# Altium schematic sheet Servos.SchDoc
size A3; SheetNumber: 5; SheetTotal: 9
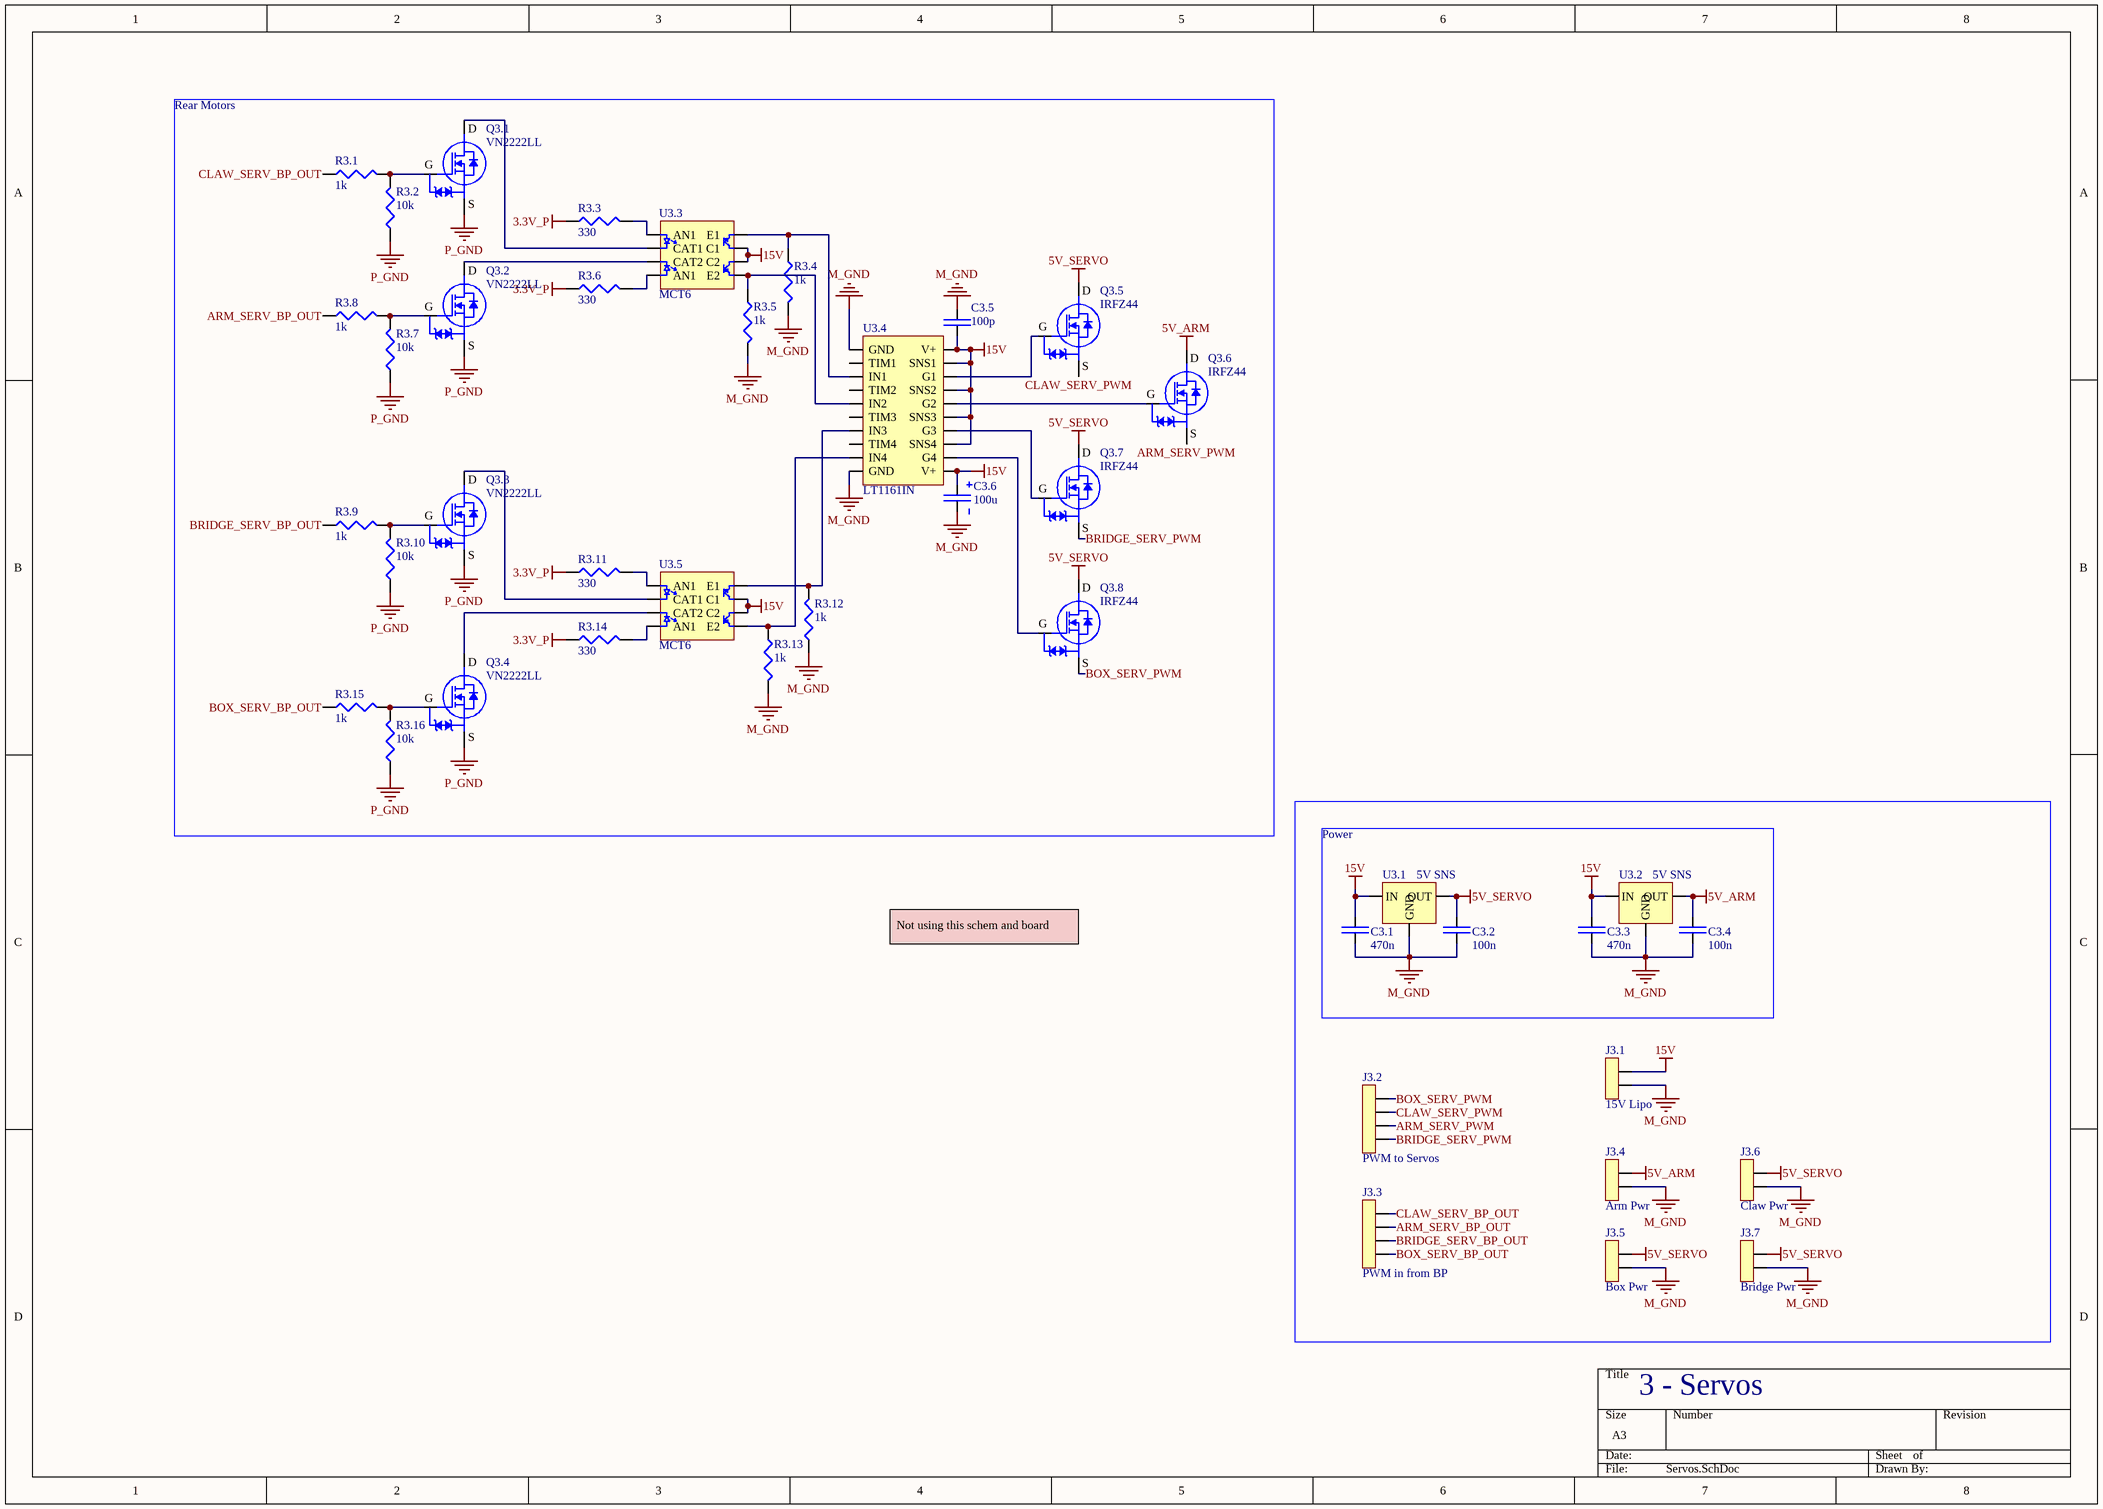
[diagram p0: Servos.SchDoc]

## Parts
C3.1  470n  [Non Polarized Cap]
C3.2  100n  [Non Polarized Cap]
C3.3  470n  [Non Polarized Cap]
C3.4  100n  [Non Polarized Cap]
C3.5  100p  [Non Polarized Cap]
C3.6  100u  [Polarized Cap]
J3.1  15V Lipo  [2pos JST]
J3.2  PWM to Servos  [4Pos JST]
J3.3  PWM in from BP  [4Pos JST]
J3.4  Arm Pwr  [2pos JST]
J3.5  Box Pwr  [2pos JST]
J3.6  Claw Pwr  [2pos JST]
J3.7  Bridge Pwr  [2pos JST]
Q3.1  VN2222LL  [VN2222LL]
Q3.2  VN2222LL  [VN2222LL]
Q3.3  VN2222LL  [VN2222LL]
Q3.4  VN2222LL  [VN2222LL]
Q3.5  IRFZ44  [TO220]
Q3.6  IRFZ44  [TO220]
Q3.7  IRFZ44  [TO220]
Q3.8  IRFZ44  [TO220]
R3.1  1k  [Res_Generic]
R3.2  10k  [Res_Generic]
R3.3  330  [Res_Generic]
R3.4  1k  [Res_Generic]
R3.5  1k  [Res_Generic]
R3.6  330  [Res_Generic]
R3.7  10k  [Res_Generic]
R3.8  1k  [Res_Generic]
R3.9  1k  [Res_Generic]
R3.10  10k  [Res_Generic]
R3.11  330  [Res_Generic]
R3.12  1k  [Res_Generic]
R3.13  1k  [Res_Generic]
R3.14  330  [Res_Generic]
R3.15  1k  [Res_Generic]
R3.16  10k  [Res_Generic]
U3.1  5V SNS  [TO220]
U3.2  5V SNS  [TO220]
U3.3  MCT6  [DIP8]
U3.4  LT1161IN  [DIP20]
U3.5  MCT6  [DIP8]

## Blocks framed on the sheet
Rear Motors: C3.5 C3.6 Q3.1-Q3.8 R3.1-R3.16 U3.3-U3.5
Power: C3.1-C3.4 U3.1 U3.2

## Nets
3.3V_P: R3.3.1 R3.6.1 R3.11.1 R3.14.1
5V_ARM: C3.4.2 J3.4.2 Q3.6.2(D) U3.2.3(OUT)
5V_SERVO: C3.2.2 J3.5.2 J3.6.2 J3.7.2 Q3.5.2(D) Q3.7.2(D) Q3.8.2(D) U3.1.3(OUT)
15V: C3.1.2 C3.3.2 C3.5.1 C3.6.1 J3.1.2 U3.1.1(IN) U3.2.1(IN) U3.3.6(C2) U3.3.7(C1) U3.4.11(V+) U3.4.13(SNS4) U3.4.15(SNS3) U3.4.17(SNS2) U3.4.19(SNS1) U3.4.20(V+) U3.5.6(C2) U3.5.7(C1)
M_GND: C3.1.1 C3.2.1 C3.3.1 C3.4.1 C3.5.2 C3.6.2 J3.1.1 J3.4.1 J3.5.1 J3.6.1 J3.7.1 R3.4.2 R3.5.2 R3.12.1 R3.13.2 U3.1.2(GND) U3.2.2(GND) U3.4.1(GND) U3.4.10(GND)
P_GND: Q3.1.1(S) Q3.2.1(S) Q3.3.1(S) Q3.4.1(S) R3.2.1 R3.7.1 R3.10.1 R3.16.1
ARM_SERV_BP_OUT: J3.3.3 R3.8.1
ARM_SERV_PWM: J3.2.2 Q3.6.3(S)
BOX_SERV_BP_OUT: J3.3.1 R3.15.1
BOX_SERV_PWM: J3.2.4 Q3.8.3(S)
BRIDGE_SERV_BP_OUT: J3.3.2 R3.9.1
BRIDGE_SERV_PWM: J3.2.1 Q3.7.3(S)
CLAW_SERV_BP_OUT: J3.3.4 R3.1.1
CLAW_SERV_PWM: J3.2.3 Q3.5.3(S)
NetQ3.1_2: Q3.1.2(G) R3.1.2 R3.2.2
NetQ3.1_3: Q3.1.3(D) U3.3.2(CAT1)
NetQ3.2_2: Q3.2.2(G) R3.7.2 R3.8.2
NetQ3.2_3: Q3.2.3(D) U3.3.3(CAT2)
NetQ3.3_2: Q3.3.2(G) R3.9.2 R3.10.2
NetQ3.3_3: Q3.3.3(D) U3.5.2(CAT1)
NetQ3.4_2: Q3.4.2(G) R3.15.2 R3.16.2
NetQ3.4_3: Q3.4.3(D) U3.5.3(CAT2)
NetQ3.5_1: Q3.5.1(G) U3.4.18(G1)
NetQ3.6_1: Q3.6.1(G) U3.4.16(G2)
NetQ3.7_1: Q3.7.1(G) U3.4.14(G3)
NetQ3.8_1: Q3.8.1(G) U3.4.12(G4)
NetR3.3_2: R3.3.2 U3.3.1(AN1)
NetR3.4_1: R3.4.1 U3.3.8(E1) U3.4.3(IN1)
NetR3.5_1: R3.5.1 U3.3.5(E2) U3.4.5(IN2)
NetR3.6_2: R3.6.2 U3.3.4(AN1)
NetR3.11_2: R3.11.2 U3.5.1(AN1)
NetR3.12_2: R3.12.2 U3.4.7(IN3) U3.5.8(E1)
NetR3.13_1: R3.13.1 U3.4.9(IN4) U3.5.5(E2)
NetR3.14_2: R3.14.2 U3.5.4(AN1)

Not connected (* = marked no-connect by the designer): U3.4 2(TIM1) 4(TIM2) 6(TIM3) 8(TIM4)

## Notes on the sheet
- Not using this schem and board
- 3 - Servos

## Library data of the parts
C3.1-C3.5 = Cap_Generic
C3.6 = Polarized Cap
J3.1 J3.4-J3.7 = 2pos Conn: 2pos Conn JST
J3.2 J3.3 = 4pos Conn
Q3.1-Q3.4 = VN2222LL NMOS: VN2222LL N-Channel 60 V 150mA 400mW Through Hole TO-92 (TO-226); Supplier 1: Mouser; Supplier Part Number 1: 689-VN2222LL-G
Q3.5-Q3.8 = IRFZ44 NMOS: IRFZ44EPBF N-Channel 60 V 48A 110W Through Hole TO-220AB; Supplier 1: Digi-Key; Supplier Part Number 1: IRFZ44ZLPBF-ND
R3.1-R3.16 = Res_Generic
U3.1 U3.2 = UA7805 5V Reg: UA7805 IC REG LINEAR 5V 1.5A TO220-3; Supplier 1: Digi-Key; Supplier Part Number 1: 296-39515-5-ND
U3.3 U3.5 = MCT6 Optocoupler: Optoisolator 5.3KV 2CH TRANS 8-DIP; Supplier 1: Mouser; Supplier Part Number 1: 512-MCT6
U3.4 = LT1161IN Gate Driver: LT1161IN High-Side Gate Driver IC Non-Inverting 20-PDIP; Supplier 1: Digi-Key; Supplier Part Number 1: LT1161IN#PBF-ND